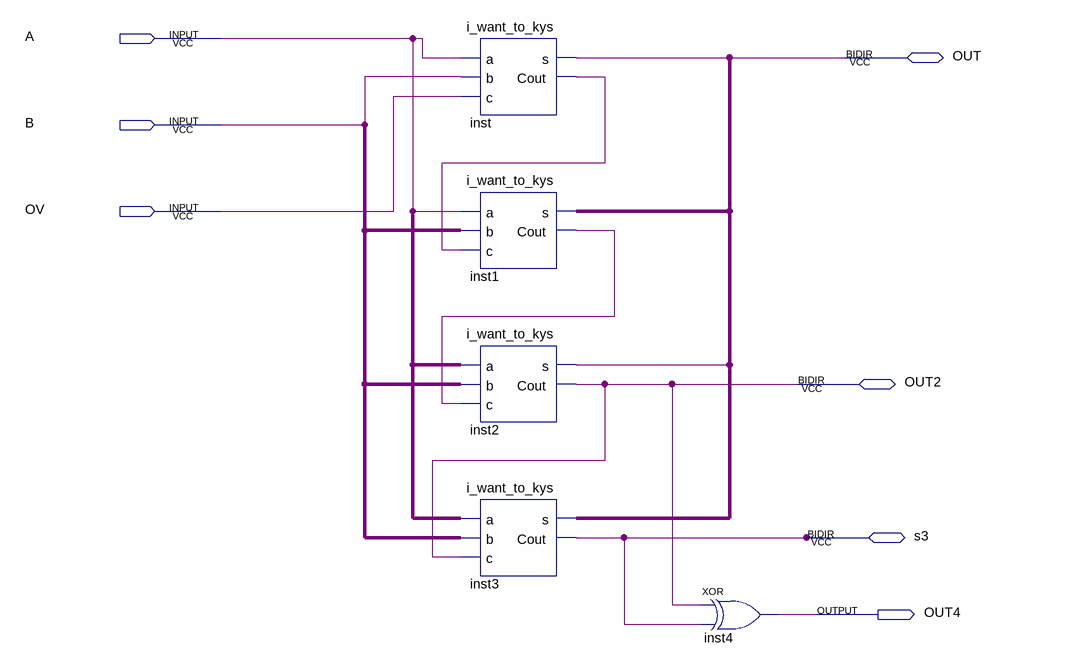
[diagram p0: schematic sheet]
// Quartus schematic shit_with_adders.bdf as structural Verilog: 5 symbols, 7 pins
module shit_with_adders (
  input  A,
  input  B,
  input  OV,
  inout  OUT,
  inout  OUT2,
  inout  s3,
  output OUT4
);

  wire inst1_cout, inst1_s, inst_cout, undriven, undriven_2;

  i_want_to_kys inst (.a(A), .b(B), .c(OV), .s(OUT), .Cout(inst_cout));
  i_want_to_kys inst1 (.a(A), .b(undriven_2), .c(inst_cout), .s(inst1_s), .Cout(inst1_cout));
  i_want_to_kys inst2 (.a(undriven), .b(undriven_2), .c(inst1_cout), .s(inst1_s), .Cout(OUT2));
  i_want_to_kys inst3 (.a(undriven), .b(undriven_2), .c(OUT2), .s(inst1_s), .Cout(s3));
  xor inst4 (OUT4, OUT2, s3);
endmodule
